# Altium schematic sheet [02] - USB.SchDoc
size A3
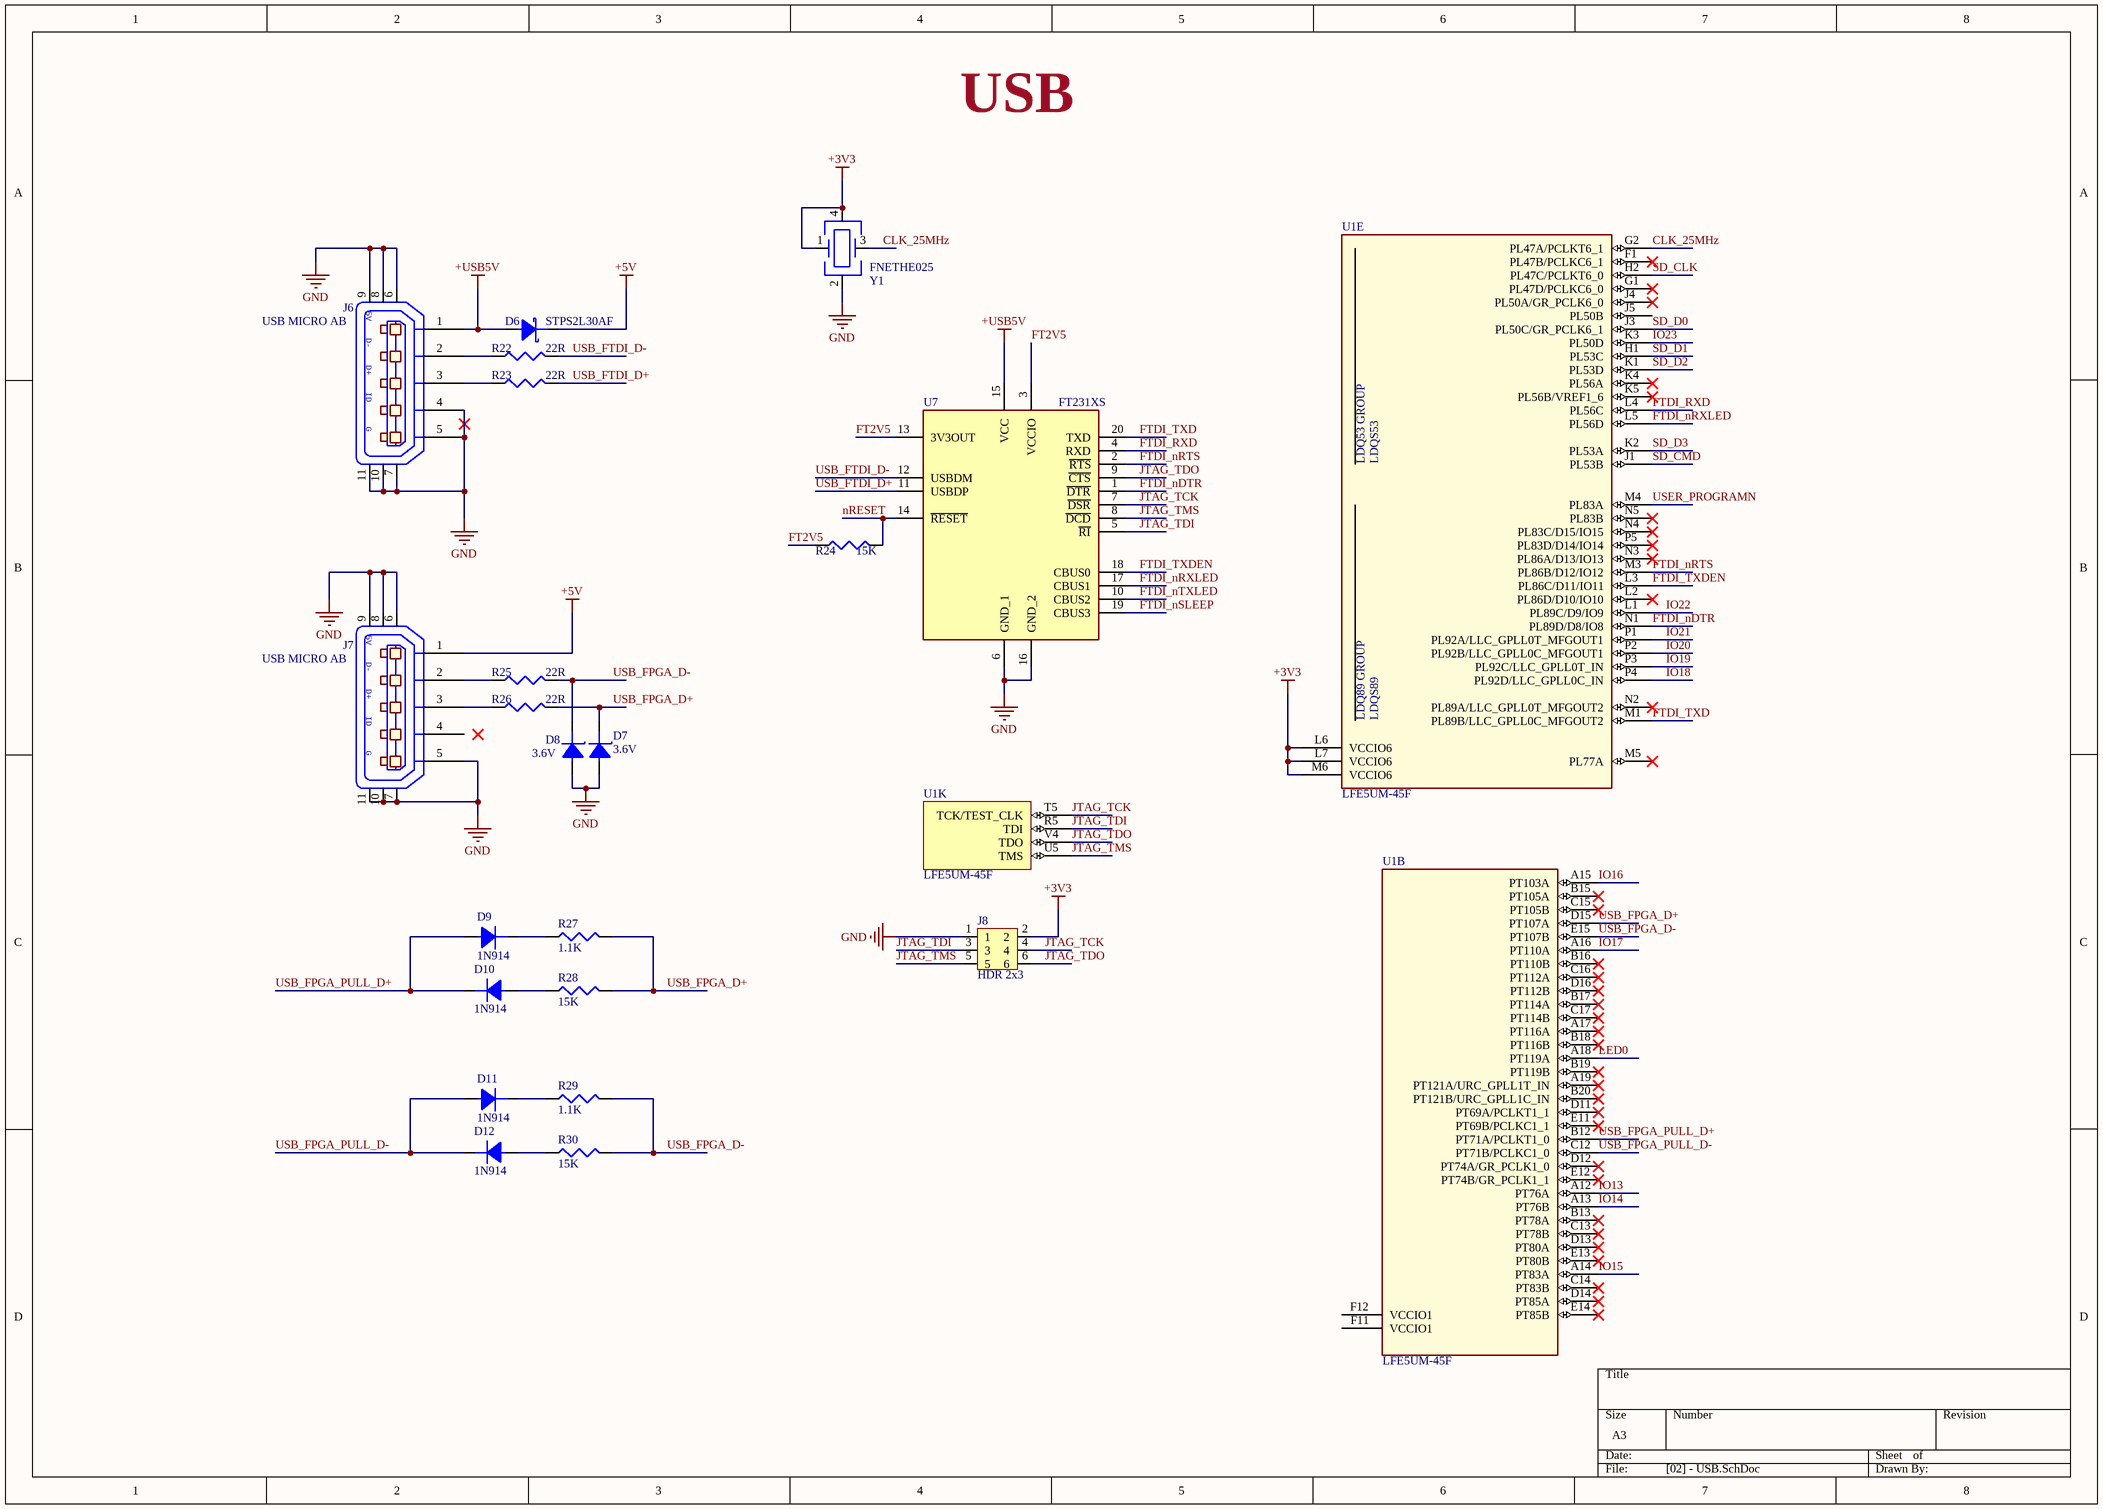
[diagram p0: [02] - USB.SchDoc]

## Parts
D6  STPS2L30AF  [SMA]
D7  3.6V  [SOD323]
D8  3.6V  [SOD323]
D9  1N914  [SOD323]
D10  1N914  [SOD323]
D11  1N914  [SOD323]
D12  1N914  [SOD323]
J6  USB MICRO AB  [USB_Micro_AB]
J7  USB MICRO AB  [USB_Micro_AB]
J8  HDR 2x3  [HDR_2x3_2.54MM]
R22  22R  [R0603]
R23  22R  [R0603]
R24  15K  [R0603]
R25  22R  [R0603]
R26  22R  [R0603]
R27  1.1K  [R0603]
R28  15K  [R0603]
R29  1.1K  [R0603]
R30  15K  [R0603]
U1  LFE5UM-45F  [LFE5BG381]  (parts B,E,K of 11)
U7  FT231XS  [SOP64P599X175-20N]
Y1  FNETHE025  [TSOP440P690X140-4N]

## Nets
+3V3: J8.2 U1.L6(VCCIO6) U1.L7(VCCIO6) U1.M6(VCCIO6) Y1.1 Y1.4
+5V: D6.1(Cathode) J7.1(P1)
+USB5V: D6.2(Anode) J6.1(P1) U7.15(VCC)
GND: D7.2(Anode) D8.2(Anode) J6.4(P4) J6.5(P5) J6.6 J6.7 J6.8 J6.9 J6.10 J6.11 J7.5(P5) J7.6 J7.7 J7.8 J7.9 J7.10 J7.11 J8.1 U7.6(GND_1) U7.16(GND_2) Y1.2
CLK_25MHz: U1.G2(PL47A/PCLKT6_1) Y1.3
FT2V5: R24.1 U7.3(VCCIO) U7.13(3V3OUT)
FTDI_nDTR: U1.N1(PL89D/D8/IO8) U7.1(~{DTR})
FTDI_nRTS: U1.M3(PL86B/D12/IO12) U7.2(~{RTS})
FTDI_nRXLED: U1.L5(PL56D) U7.17(CBUS1)
FTDI_nSLEEP: U7.19(CBUS3)
FTDI_nTXLED: U7.10(CBUS2)
FTDI_RXD: U1.L4(PL56C) U7.4(RXD)
FTDI_TXD: U1.M1(PL89B/LLC_GPLL0C_MFGOUT2) U7.20(TXD)
FTDI_TXDEN: U1.L3(PL86C/D11/IO11) U7.18(CBUS0)
IO13: U1.A12(PT76A)
IO14: U1.A13(PT76B)
IO15: U1.A14(PT83A)
IO16: U1.A15(PT103A)
IO17: U1.A16(PT110A)
IO18: U1.P4(PL92D/LLC_GPLL0C_IN)
IO19: U1.P3(PL92C/LLC_GPLL0T_IN)
IO20: U1.P2(PL92B/LLC_GPLL0C_MFGOUT1)
IO21: U1.P1(PL92A/LLC_GPLL0T_MFGOUT1)
IO22: U1.L1(PL89C/D9/IO9)
IO23: U1.K3(PL50D)
JTAG_TCK: J8.4 U1.T5(TCK/TEST_CLK) U7.7(~{DSR})
JTAG_TDI: J8.3 U1.R5(TDI) U7.5(~{RI})
JTAG_TDO: J8.6 U1.V4(TDO) U7.9(~{CTS})
JTAG_TMS: J8.5 U1.U5(TMS) U7.8(~{DCD})
LED0: U1.A18(PT119A)
nRESET: R24.2 U7.14(~{RESET})
SD_CLK: U1.H2(PL47C/PCLKT6_0)
SD_CMD: U1.J1(PL53B)
SD_D0: U1.J3(PL50C/GR_PCLK6_1)
SD_D1: U1.H1(PL53C)
SD_D2: U1.K1(PL53D)
SD_D3: U1.K2(PL53A)
USB_FPGA_D+: D7.1(Cathode) R26.2 R27.2 R28.2 U1.D15(PT107A)
USB_FPGA_D-: D8.1(Cathode) R25.2 R29.2 R30.2 U1.E15(PT107B)
USB_FPGA_PULL_D+: D9.2(Anode) D10.1(Cathode) U1.B12(PT71A/PCLKT1_0)
USB_FPGA_PULL_D-: D11.2(Anode) D12.1(Cathode) U1.C12(PT71B/PCLKC1_0)
USB_FTDI_D+: R23.2 U7.11(USBDP)
USB_FTDI_D-: R22.2 U7.12(USBDM)
USER_PROGRAMN: U1.M4(PL83A)
NetD9_1: D9.1(Cathode) R27.1
NetD10_2: D10.2(Anode) R28.1
NetD11_1: D11.1(Cathode) R29.1
NetD12_2: D12.2(Anode) R30.1
NetJ6_2: J6.2(P2) R22.1
NetJ6_3: J6.3(P3) R23.1
NetJ7_2: J7.2(P2) R25.1
NetJ7_3: J7.3(P3) R26.1

Not connected (* = marked no-connect by the designer): J7 4(P4); U1 A17(PT116A)* A19(PT121A/URC_GPLL1T_IN)* B13(PT78A)* B15(PT105A)* B16(PT110B)* B17(PT114A)* B18(PT116B)* B19(PT119B)* B20(PT121B/URC_GPLL1C_IN)* C13(PT78B)* C14(PT83B)* C15(PT105B)* C16(PT112A)* C17(PT114B)* D11(PT69A/PCLKT1_1)* D12(PT74A/GR_PCLK1_0)* D13(PT80A)* D14(PT85A)* D16(PT112B)* E11(PT69B/PCLKC1_1)* E12(PT74B/GR_PCLK1_1)* E13(PT80B)* E14(PT85B)* F1(PL47B/PCLKC6_1)* F11(VCCIO1) F12(VCCIO1) G1(PL47D/PCLKC6_0)* J4(PL50A/GR_PCLK6_0)* J5(PL50B) K4(PL56A)* K5(PL56B/VREF1_6)* L2(PL86D/D10/IO10)* M5(PL77A)* N2(PL89A/LLC_GPLL0T_MFGOUT2)* N3(PL86A/D13/IO13)* N4(PL83C/D15/IO15)* N5(PL83B)* P5(PL83D/D14/IO14)*

## Notes on the sheet
- USB
- (in symbol 0475890001) 5V; D-; D+; ID; G
- (in symbol LFE5UM-45F-6BG381C, part E) LDQ53 GROUP; LDQS53; LDQ89 GROUP; LDQS89

## Library data of the parts
D6 = STPS2L30AF: DIODE SCHOTTKY 30V 2A SMA; Manufacturer: STMicroelectronics; Forward Voltage: 530mV; Peak Reverse Current: 200uA; Max Surge Current: 75A; Element Configuration: Single; Supplier 1: Digi-Key; Manufacturer Part Number: STPS2L30AF; Stock 1: 8523; Pricing 1: 1=0.45, 10=0.386, 25=0.3604, 100=0.2678, 250=0.2544, 500=0.2091, 1000=0.16995, 2500=0.15965, 5000=0.1442 (USD); Mount: Surface Mount; Case/Package: SMA; Number of Pins: 2; Min Operating Temperature: -65°C; Max Operating Temperature: 150°C; Package Quantity: 1; Packaging: Tape and Reel; Forward Current: 2A; Average Rectified Current: 2A; Max Reverse Leakage Current: 200uA; Max Repetitive Reverse Voltage (Vrrm): 30V; Peak Non-Repetitive Surge Current: 75A; Max Forward Surge Current (Ifsm): 75A; Max Reverse Voltage (DC): 30V; Radiation Hardening: No; REACH SVHC: No SVHC; Lead Free: Lead Free; ComponentLink1URL: http://www.st.com/content/ccc/resource/technical/document/datasheet/62/6b/2e/7f/34/cb/43/55/CD00001633.pdf/files/CD00001633.pdf/jcr:content/translations/en.CD00001633.pdf?src-supplier=Digi-Key; ComponentLink1Description: http://www.st.com/content/ccc/resource/technical/document/datasheet/62/6b/2e/7f/34/cb/43/55/CD00001633.pdf/files/CD00001633.pdf/jcr:content/translations/en.CD00001633.pdf?src-supplier=Digi-Key; ComponentLink2URL: http://www.st.com/st-web-ui/static/active/en/resource/technical/document/datasheet/CD00001633.pdf?src-supplier=Future+Electronics; ComponentLink2Description: http://www.st.com/st-web-ui/static/active/en/resource/technical/document/datasheet/CD00001633.pdf?src-supplier=Future+Electronics; ComponentLink3URL: http://www.st.com/st-web-ui/static/active/en/resource/technical/document/datasheet/CD00001633.pdf?src-supplier=Mouser; ComponentLink3Description: http://www.st.com/st-web-ui/static/active/en/resource/technical/document/datasheet/CD00001633.pdf?src-supplier=Mouser; Supplier Part Number 1: 497-12310-6-ND
D7 D8 = BZT52C3V6S-TP: Diode Zener Single 3.6V 5% 200mW 2-Pin SOD-323 T/R; Manufacturer: MCC; Tolerance: 6%; Impedance: 90R; Max Reverse Leakage Current: 15uA; Test Current: 5mA; Supplier 1: Digi-Key; Manufacturer Part Number: BZT52C3V6S-TP; Stock 1: 5023; Pricing 1: 1=0.26, 10=0.215, 25=0.18, 100=0.088, 250=0.0866, 500=0.0734, 1000=0.051 (USD); Mount: Surface Mount; Number of Pins: 2; Min Operating Temperature: -65°C; Max Operating Temperature: 175°C; Package Quantity: 3000; Packaging: Tape and Reel; Zener Voltage: 3.6V; Max Power Dissipation: 200mW; Power Dissipation: 200mW; Voltage Tolerance: 5%; Element Configuration: Single; Power Rating: 200mW; Voltage Rating (DC): 3.6V; Lead Free: Lead Free; ComponentLink1URL: http://www.mccsemi.com/up_pdf/BZT52C2V4S~BZT52C39S(200mW)(SOD323).pdf?src-supplier=Digi-Key; ComponentLink1Description: http://www.mccsemi.com/up_pdf/BZT52C2V4S~BZT52C39S(200mW)(SOD323).pdf?src-supplier=Digi-Key; ComponentLink2URL: http://www.mouser.com/ds/2/258/BZT52C2V4S~BZT52C39S(200mW)(SOD323)-479732.pdf?src-supplier=Mouser; ComponentLink2Description: http://www.mouser.com/ds/2/258/BZT52C2V4S~BZT52C39S(200mW)(SOD323)-479732.pdf?src-supplier=Mouser; ComponentLink3URL: http://components.arrow.com/part/dataview/45991456S304003N2022?src-supplier=Arrow; ComponentLink3Description: http://components.arrow.com/part/dataview/45991456S304003N2022?src-supplier=Arrow; Supplier Part Number 1: BZT52C3V6S-TPMSDKR-ND
D9-D12 = 1N914BWS: ON SEMICONDUCTOR/FAIRCHILD - 1N914BWS. - SMALL SIGNAL DIODE; Forward Current: 150mA; Peak Reverse Current: 5uA; Max Repetitive Reverse Voltage (Vrrm): 75V; Element Configuration: Single; Forward Voltage: 1V; Power Dissipation: 200mW; Reverse Recovery Time: 4ns; Max Forward Surge Current (Ifsm): 4A; Supplier 1: Digi-Key; Manufacturer: ON Semiconductor / Fairchild; Manufacturer Part Number: 1N914BWS; Stock 1: 133438; Pricing 1: 1=0.16, 10=0.147, 25=0.14, 100=0.0616, 250=0.05912, 500=0.04838, 1000=0.0336 (USD); Mount: Surface Mount; Number of Pins: 2; Weight: 0.0276g; Contact Plating: Tin,Matte; Min Operating Temperature: -55°C; Max Operating Temperature: 150°C; Packaging: Tape and Reel; Package Quantity: 1; Average Rectified Current: 150mA; Max Reverse Voltage (DC): 75V; Reverse Voltage: 75V; Recovery Time: 4ns; Length: 1.8mm; Height: 1mm; Width: 1.35mm; Radiation Hardening: No; Lead Free: Lead Free; REACH SVHC: No SVHC; ComponentLink1URL: https://www.fairchildsemi.com/datasheets/1N/1N4148WS.pdf?src-supplier=Digi-Key; ComponentLink1Description: https://www.fairchildsemi.com/datasheets/1N/1N4148WS.pdf?src-supplier=Digi-Key; ComponentLink2URL: https://www.onsemi.com/pub/Collateral/1N914BWS-D.pdf?src-supplier=Digi-Key; ComponentLink2Description: https://www.onsemi.com/pub/Collateral/1N914BWS-D.pdf?src-supplier=Digi-Key; ComponentLink3URL: http://www.fairchildsemi.com/ds/1N/1N914BWS.pdf?src-supplier=Future+Electronics; ComponentLink3Description: http://www.fairchildsemi.com/ds/1N/1N914BWS.pdf?src-supplier=Future+Electronics; ComponentLink4URL: http://www.farnell.com/datasheets/1771770.pdf?src-supplier=Element14; ComponentLink4Description: http://www.farnell.com/datasheets/1771770.pdf?src-supplier=Element14; ComponentLink5URL: https://www.fairchildsemi.com/datasheets/1N/1N914BWS.pdf?src-supplier=Avnet; ComponentLink5Description: https://www.fairchildsemi.com/datasheets/1N/1N914BWS.pdf?src-supplier=Avnet; ComponentLink6URL: http://www.fairchildsemi.com/ds/1N/1N914BWS.pdf?src-supplier=Avnet+Europe; ComponentLink6Description: http://www.fairchildsemi.com/ds/1N/1N914BWS.pdf?src-supplier=Avnet+Europe; Supplier Part Number 1: 1N914BWSDKR-ND
J6 J7 = 0475890001: CONN RCPT MICRO USB AB R/A SMD; Manufacturer: Molex Inc; Connector Type: USB - micro AB; Number of Contacts: 5; Gender: Receptacle; .Creator: MM; Supplier 1: Digi-Key; Manufacturer Part Number: 0475890001; RoHS: RoHS Compliant; Category: Connectors, Interconnects; Stock 1: 12754; Pricing 1: 1=0.81, 10=0.764, 25=0.6872, 50=0.6108, 100=0.5854, 250=0.53452, 500=0.50908 (USD); Packaging: Cut Tape (CT); Specifications: -; Mounting Type: Surface Mount, Right Angle, Horizontal; Features: Board Guide, Shielded; Ingress Protection: -; ComponentLink1URL: http://www.molex.com/pdm_docs/sd/475890001_sd.pdf; ComponentLink1Description: http://www.molex.com/pdm_docs/sd/475890001_sd.pdf; Supplier Part Number 1: WM17143CT-ND; .Checked PCB: MM; .Checked SCH: MM
J8 = 67997-106HLF: CONN HEADER VERT 6POS 2.54MM; Manufacturer: Amphenol FCI; Number of Contacts: 6; Current Rating: 3A; Voltage Rating: 1.5kV; Insulation Resistance: 5GR; Gender: Male; Connector Type: Male Pin; Row Spacing: 0.1inch; Contact Post Length: 3.05mm; Supplier 1: Digi-Key; Manufacturer Part Number: 67997-106HLF; Stock 1: 906; Pricing 1: 1=1.73, 10=1.568, 100=1.3436, 500=1.11966, 1000=0.9597, 5000=0.85093, 10000=0.83174 (USD); Mount: Through Hole; Contact Plating: Gold,GXT; Contact Material: Bronze; Color: Black; Housing Color: Black; Housing Material: Thermoplastic; Min Operating Temperature: -65°C; Max Operating Temperature: 125°C; Number of Rows: 2; Termination: Through Hole; Packaging: Bulk; Package Quantity: 100; Contact Gender: Male; Number of Positions: 6; Max Voltage Rating (AC): 1.5kV; Orientation: Straight; Length: 7.62mm; Pitch: 2.54mm; Contact Mating Length: 0.23inch; Depth: 4.83mm; Radiation Hardening: No; REACH SVHC: No SVHC; Lead Free: Lead Free; Flammability Rating: UL94 V-0; ComponentLink1URL: https://cdn.amphenol-icc.com/media/wysiwyg/files/drawing/67996.pdf?src-supplier=Avnet; ComponentLink1Description: https://cdn.amphenol-icc.com/media/wysiwyg/files/drawing/67996.pdf?src-supplier=Avnet; ComponentLink2URL: https://cdn.amphenol-icc.com/media/wysiwyg/files/drawing/67996.pdf?src-supplier=Digi-Key; ComponentLink2Description: https://cdn.amphenol-icc.com/media/wysiwyg/files/drawing/67996.pdf?src-supplier=Digi-Key; ComponentLink3URL: https://cdn.amphenol-icc.com/media/wysiwyg/files/drawing/67996.pdf?src-supplier=Mouser; ComponentLink3Description: https://cdn.amphenol-icc.com/media/wysiwyg/files/drawing/67996.pdf?src-supplier=Mouser; ComponentLink4URL: https://cdn.amphenol-icc.com/media/wysiwyg/files/drawing/67996.pdf?src-supplier=Avnet+Europe; ComponentLink4Description: https://cdn.amphenol-icc.com/media/wysiwyg/files/drawing/67996.pdf?src-supplier=Avnet+Europe; Supplier Part Number 1: 609-3393-ND
R22 R23 R25 R26 = RC0603FR-0722RL: Res Thick Film 0603 22 Ohm 1% 0.1W(1/10W) ±100ppm/C Pad SMD T/R; Manufacturer: Yageo; Temperature Coefficient: 100ppm/°C; Voltage Rating (DC): 50V; Power Rating: 100mW; Supplier 1: Digi-Key; Manufacturer Part Number: RC0603FR-0722RL; Stock 1: 736588; Pricing 1: 1=0.1, 10=0.023, 100=0.0094, 1000=0.00421, 2500=0.00366 (USD); Case/Package: 0603; Number of Pins: 2; Case Code (Metric): 1608; Case Code (Imperial): 0603; Min Operating Temperature: -55°C; Max Operating Temperature: 155°C; Tolerance: 1%; Resistance: 22R; Composition: Thick Film; Packaging: Tape and Reel; Voltage Rating: 50V; Package Quantity: 1; Number of Terminations: 2; Termination: SMD/SMT; Military Standard: Not; Max Power Dissipation: 100mW; Features: Moisture Resistant; Length: 1.6mm; Height: 0.022inch; Width: 0.031inch; Depth: 0.8mm; REACH SVHC: No SVHC; Lead Free: Lead Free; ComponentLink1URL: http://www.yageo.com/documents/recent/PYu-RC_Group_51_RoHS_L_10.pdf?src-supplier=Digi-Key; ComponentLink1Description: http://www.yageo.com/documents/recent/PYu-RC_Group_51_RoHS_L_10.pdf?src-supplier=Digi-Key; ComponentLink2URL: http://documents.rs-components.com/techlib://itc_doclist_GB.htm?stockno=5050369&src-supplier=RSComponents; ComponentLink2Description: http://documents.rs-components.com/techlib://itc_doclist_GB.htm?stockno=5050369&src-supplier=RSComponents; ComponentLink3URL: http://www.farnell.com/datasheets/2167052.pdf?src-supplier=Element14; ComponentLink3Description: http://www.farnell.com/datasheets/2167052.pdf?src-supplier=Element14; ComponentLink4URL: http://www.farnell.com/datasheets/443971.pdf?src-supplier=Element14; ComponentLink4Description: http://www.farnell.com/datasheets/443971.pdf?src-supplier=Element14; Supplier Part Number 1: 311-22.0HRCT-ND
R24 R28 R30 = RC0603FR-0715KL: Res Thick Film 0603 15K Ohm 1% 1/10W ?100ppm/?C Molded SMD Paper T/R; Manufacturer: Yageo; Temperature Coefficient: 100ppm/°C; Resistance: 15kR; Power Rating: 100mW; Voltage Rating (DC): 50V; Supplier 1: Digi-Key; Manufacturer Part Number: RC0603FR-0715KL; Stock 1: 3342455; Pricing 1: 1=0.1, 10=0.023, 100=0.0094, 1000=0.00421, 2500=0.00366 (USD); Case/Package: 0603; Number of Pins: 2; Case Code (Metric): 1608; Case Code (Imperial): 0603; Min Operating Temperature: -55°C; Max Operating Temperature: 155°C; Tolerance: 1%; Composition: Thick Film; Packaging: Tape and Reel; Package Quantity: 1; Voltage Rating: 50V; Number of Terminations: 2; Termination: SMD/SMT; Military Standard: Not; Max Power Dissipation: 100mW; Features: Moisture Resistant; Length: 1.6mm; Height: 0.022inch; Width: 0.031inch; Depth: 0.8mm; Lead Free: Lead Free; REACH SVHC: Unknown; ComponentLink1URL: http://www.yageo.com/documents/recent/PYu-RC_Group_51_RoHS_L_10.pdf?src-supplier=Digi-Key; ComponentLink1Description: http://www.yageo.com/documents/recent/PYu-RC_Group_51_RoHS_L_10.pdf?src-supplier=Digi-Key; ComponentLink2URL: http://www.yageo.com/documents/recent/PYu-RC_Group_51_RoHS_L_9.pdf?src-supplier=Digi-Key; ComponentLink2Description: http://www.yageo.com/documents/recent/PYu-RC_Group_51_RoHS_L_9.pdf?src-supplier=Digi-Key; ComponentLink3URL: https://www.verical.com/server-webapp/html/getDatasheet?partID=327895&src-supplier=Verical; ComponentLink3Description: https://www.verical.com/server-webapp/html/getDatasheet?partID=327895&src-supplier=Verical; Supplier Part Number 1: 311-15.0KHRCT-ND
R27 R29 = RC0603FR-071K1L: RES SMD 1.1K OHM 1% 1/10W 0603; Manufacturer: Yageo; Power Rating: 100mW; Temperature Coefficient: 100ppm/°C; Resistance: 1.1kR; Voltage Rating: 50V; Supplier 1: Digi-Key; Manufacturer Part Number: RC0603FR-071K1L; Stock 1: 534181; Pricing 1: 1=0.1, 10=0.023, 100=0.0094, 1000=0.00421, 2500=0.00366 (USD); Case/Package: 0603; Number of Pins: 2; Case Code (Metric): 1608; Case Code (Imperial): 0603; Min Operating Temperature: -55°C; Max Operating Temperature: 155°C; Tolerance: 1%; Package Quantity: 1; Packaging: Tape and Reel; Composition: Thick Film; Number of Terminations: 2; Termination: SMD/SMT; Military Standard: Not; Max Power Dissipation: 100mW; Voltage Rating (DC): 50V; Features: Moisture Resistant; Length: 1.6mm; Height: 0.022inch; Depth: 0.8mm; Width: 0.031inch; REACH SVHC: No SVHC; Lead Free: Lead Free; ComponentLink1URL: http://www.yageo.com/documents/recent/PYu-RC_Group_51_RoHS_L_10.pdf?src-supplier=Digi-Key; ComponentLink1Description: http://www.yageo.com/documents/recent/PYu-RC_Group_51_RoHS_L_10.pdf?src-supplier=Digi-Key; ComponentLink2URL: http://www.yageo.com/documents/recent/PYu-RC_Group_51_RoHS_L_9.pdf?src-supplier=Digi-Key; ComponentLink2Description: http://www.yageo.com/documents/recent/PYu-RC_Group_51_RoHS_L_9.pdf?src-supplier=Digi-Key; Supplier Part Number 1: 311-1.10KHRDKR-ND
U1 = LFE5UM-45F-6BG381C: ECP5 Series 44 K LUTs 203 I/O 1.1 V Slow Surface Mount FPGA - CABGA-381; Manufacturer: Lattice Semiconductor; Number of Logic Blocks (LABs): 11000; Number of Logic Elements/Cells: 44000; RAM Size: 1990656b; Number of I/Os: 203; Supplier 1: Digi-Key; Manufacturer Part Number: LFE5UM-45F-6BG381C; Stock 1: 0; Pricing 1: 90=19.13967 (USD); Mount: Surface Mount; Case/Package: FBGA; Min Operating Temperature: 0°C; Max Operating Temperature: 85°C; Lead Free: Lead Free; ComponentLink1URL: http://www.latticesemi.com/~/media/LatticeSemi/Documents/DataSheets/ECP5/DS1044.pdf?src-supplier=Digi-Key; ComponentLink1Description: http://www.latticesemi.com/~/media/LatticeSemi/Documents/DataSheets/ECP5/DS1044.pdf?src-supplier=Digi-Key; Supplier Part Number 1: 220-1994-ND
U7 = FT231XS-R: FTDI - FT231XS-R - USB Interface, Transceiver, USB 2.0, 2.97 V, 5.5 V, SSOP, 20 RoHS Compliant: Yes; Max Supply Voltage: 5.5V; Min Supply Voltage: 2.97V; Number of Channels: 1; Operating Supply Voltage: 5V; Data Rate: 12Mbps; Interface: UART,USB; Operating Supply Current: 8mA; Supplier 1: Digi-Key; Manufacturer: FTDI; Manufacturer Part Number: FT231XS-R; Stock 1: 6035; Pricing 1: 1=2.12, 25=2.05, 100=1.98, 250=1.78, 500=1.6, 1000=1.55 (USD); Mount: Surface Mount; Case/Package: SSOP; Number of Pins: 20; Weight: 0.016oz; Min Operating Temperature: -40°C; Max Operating Temperature: 85°C; Packaging: Tape and Reel; Package Quantity: 2000; Length: 8.74mm; Height: 0.059inch; Width: 0.157inch; Radiation Hardening: No; ComponentLink1URL: http://uk.rs-online.com/webdocs/1102/0900766b811020d3.pdf?src-supplier=RSComponents; ComponentLink1Description: http://uk.rs-online.com/webdocs/1102/0900766b811020d3.pdf?src-supplier=RSComponents; ComponentLink2URL: https://media.digikey.com/pdf/Data%20Sheets/FTDI%20Chip%20PDFs/X-Chip_Series_Errata.pdf?src-supplier=Digi-Key; ComponentLink2Description: https://media.digikey.com/pdf/Data%20Sheets/FTDI%20Chip%20PDFs/X-Chip_Series_Errata.pdf?src-supplier=Digi-Key; ComponentLink3URL: http://www.ftdichip.com/Support/Documents/DataSheets/ICs/DS_FT231X.pdf?src-supplier=Digi-Key; ComponentLink3Description: http://www.ftdichip.com/Support/Documents/DataSheets/ICs/DS_FT231X.pdf?src-supplier=Digi-Key; ComponentLink4URL: http://www.alliedelec.com/images/products/datasheets/bm/FTDI/70403932.pdf?src-supplier=Allied+Electronics; ComponentLink4Description: http://www.alliedelec.com/images/products/datasheets/bm/FTDI/70403932.pdf?src-supplier=Allied+Electronics; Supplier Part Number 1: 768-1129-6-ND
Y1 = FNETHE025: SMD Crystal Oscillator 25MHz 3.3V 15pF 4-Pin CSMD; Manufacturer: Diodes; Frequency Stability: 25ppm; Max Supply Voltage: 3.63V; Min Supply Voltage: 2.97V; Max Supply Current: 15mA; Supplier 1: Digi-Key; Manufacturer Part Number: FNETHE025; Stock 1: 7023; Pricing 1: 1=1.1, 10=0.97, 50=0.9068, 100=0.8014, 500=0.75924 (USD); Mount: Surface Mount; Case/Package: CSMD; Number of Pins: 4; Min Operating Temperature: -20°C; Max Operating Temperature: 70°C; Frequency: 25MHz; Load Capacitance: 15pF; Operating Supply Voltage: 3.3V; Packaging: Tape and Reel; Package Quantity: 1000; Termination: SMD/SMT; Length: 7mm; Height: 0.061inch; Width: 0.197inch; Depth: 5mm; Radiation Hardening: No; Lead Free: Lead Free; ComponentLink1URL: http://www.pericom.com/assets/Datasheets/FNETHE025.pdf?src-supplier=Avnet+Europe; ComponentLink1Description: http://www.pericom.com/assets/Datasheets/FNETHE025.pdf?src-supplier=Avnet+Europe; ComponentLink2URL: https://www.verical.com/server-webapp/html/getDatasheet?partID=362555&src-supplier=Verical; ComponentLink2Description: https://www.verical.com/server-webapp/html/getDatasheet?partID=362555&src-supplier=Verical; ComponentLink3URL: http://www.pericom.com/assets/Datasheets/FNETHE025-Rev-E.pdf?src-supplier=Future+Electronics; ComponentLink3Description: http://www.pericom.com/assets/Datasheets/FNETHE025-Rev-E.pdf?src-supplier=Future+Electronics; ComponentLink4URL: https://www.diodes.com/assets/Datasheets/FNETHE025.pdf?src-supplier=Digi-Key; ComponentLink4Description: https://www.diodes.com/assets/Datasheets/FNETHE025.pdf?src-supplier=Digi-Key; ComponentLink5URL: https://media.digikey.com/pdf/Data%20Sheets/Diodes%20PDFs/FNETHE025.pdf?src-supplier=Digi-Key; ComponentLink5Description: https://media.digikey.com/pdf/Data%20Sheets/Diodes%20PDFs/FNETHE025.pdf?src-supplier=Digi-Key; ComponentLink6URL: http://www.pericom.com/assets/Datasheets/FNETHE025.pdf?src-supplier=Avnet; ComponentLink6Description: http://www.pericom.com/assets/Datasheets/FNETHE025.pdf?src-supplier=Avnet; Supplier Part Number 1: FNETHE025DKR-ND